# Altium schematic sheet _spi0.SchDoc
size Tabloid
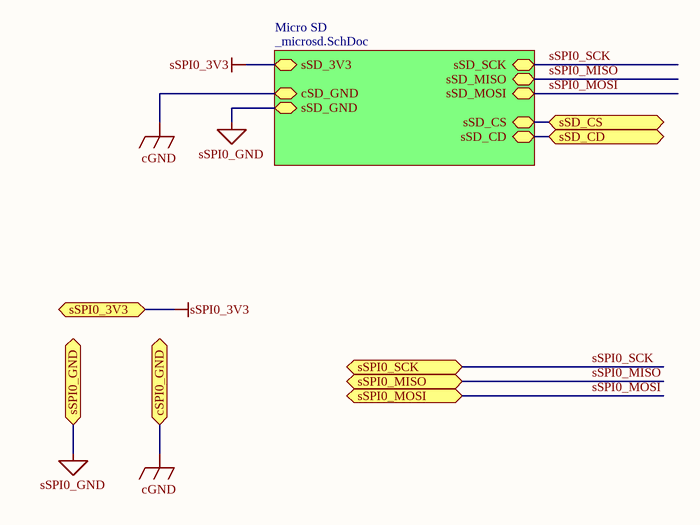
[diagram p0: _spi0.SchDoc]

## Sub-sheets
Micro SD = _microsd.SchDoc: sSD_3V3, sSD_GND, cSD_GND, sSD_SCK, sSD_MISO, sSD_MOSI, sSD_CD, sSD_CS

## Ports
cSPI0_GND, sSD_CD, sSD_CS, sSPI0_3V3, sSPI0_GND, sSPI0_MISO, sSPI0_MOSI, sSPI0_SCK

## Nets
cGND: port cSPI0_GND, sheet Micro SD/cSD_GND
sSPI0_3V3: port sSPI0_3V3, sheet Micro SD/sSD_3V3
sSPI0_GND: port sSPI0_GND, sheet Micro SD/sSD_GND
sSD_CD: port sSD_CD, sheet Micro SD/sSD_CD
sSD_CS: port sSD_CS, sheet Micro SD/sSD_CS
sSPI0_MISO: port sSPI0_MISO, sheet Micro SD/sSD_MISO
sSPI0_MOSI: port sSPI0_MOSI, sheet Micro SD/sSD_MOSI
sSPI0_SCK: port sSPI0_SCK, sheet Micro SD/sSD_SCK